# EAGLE schematic HalfECB-Starter (EAGLE 9.3.0)
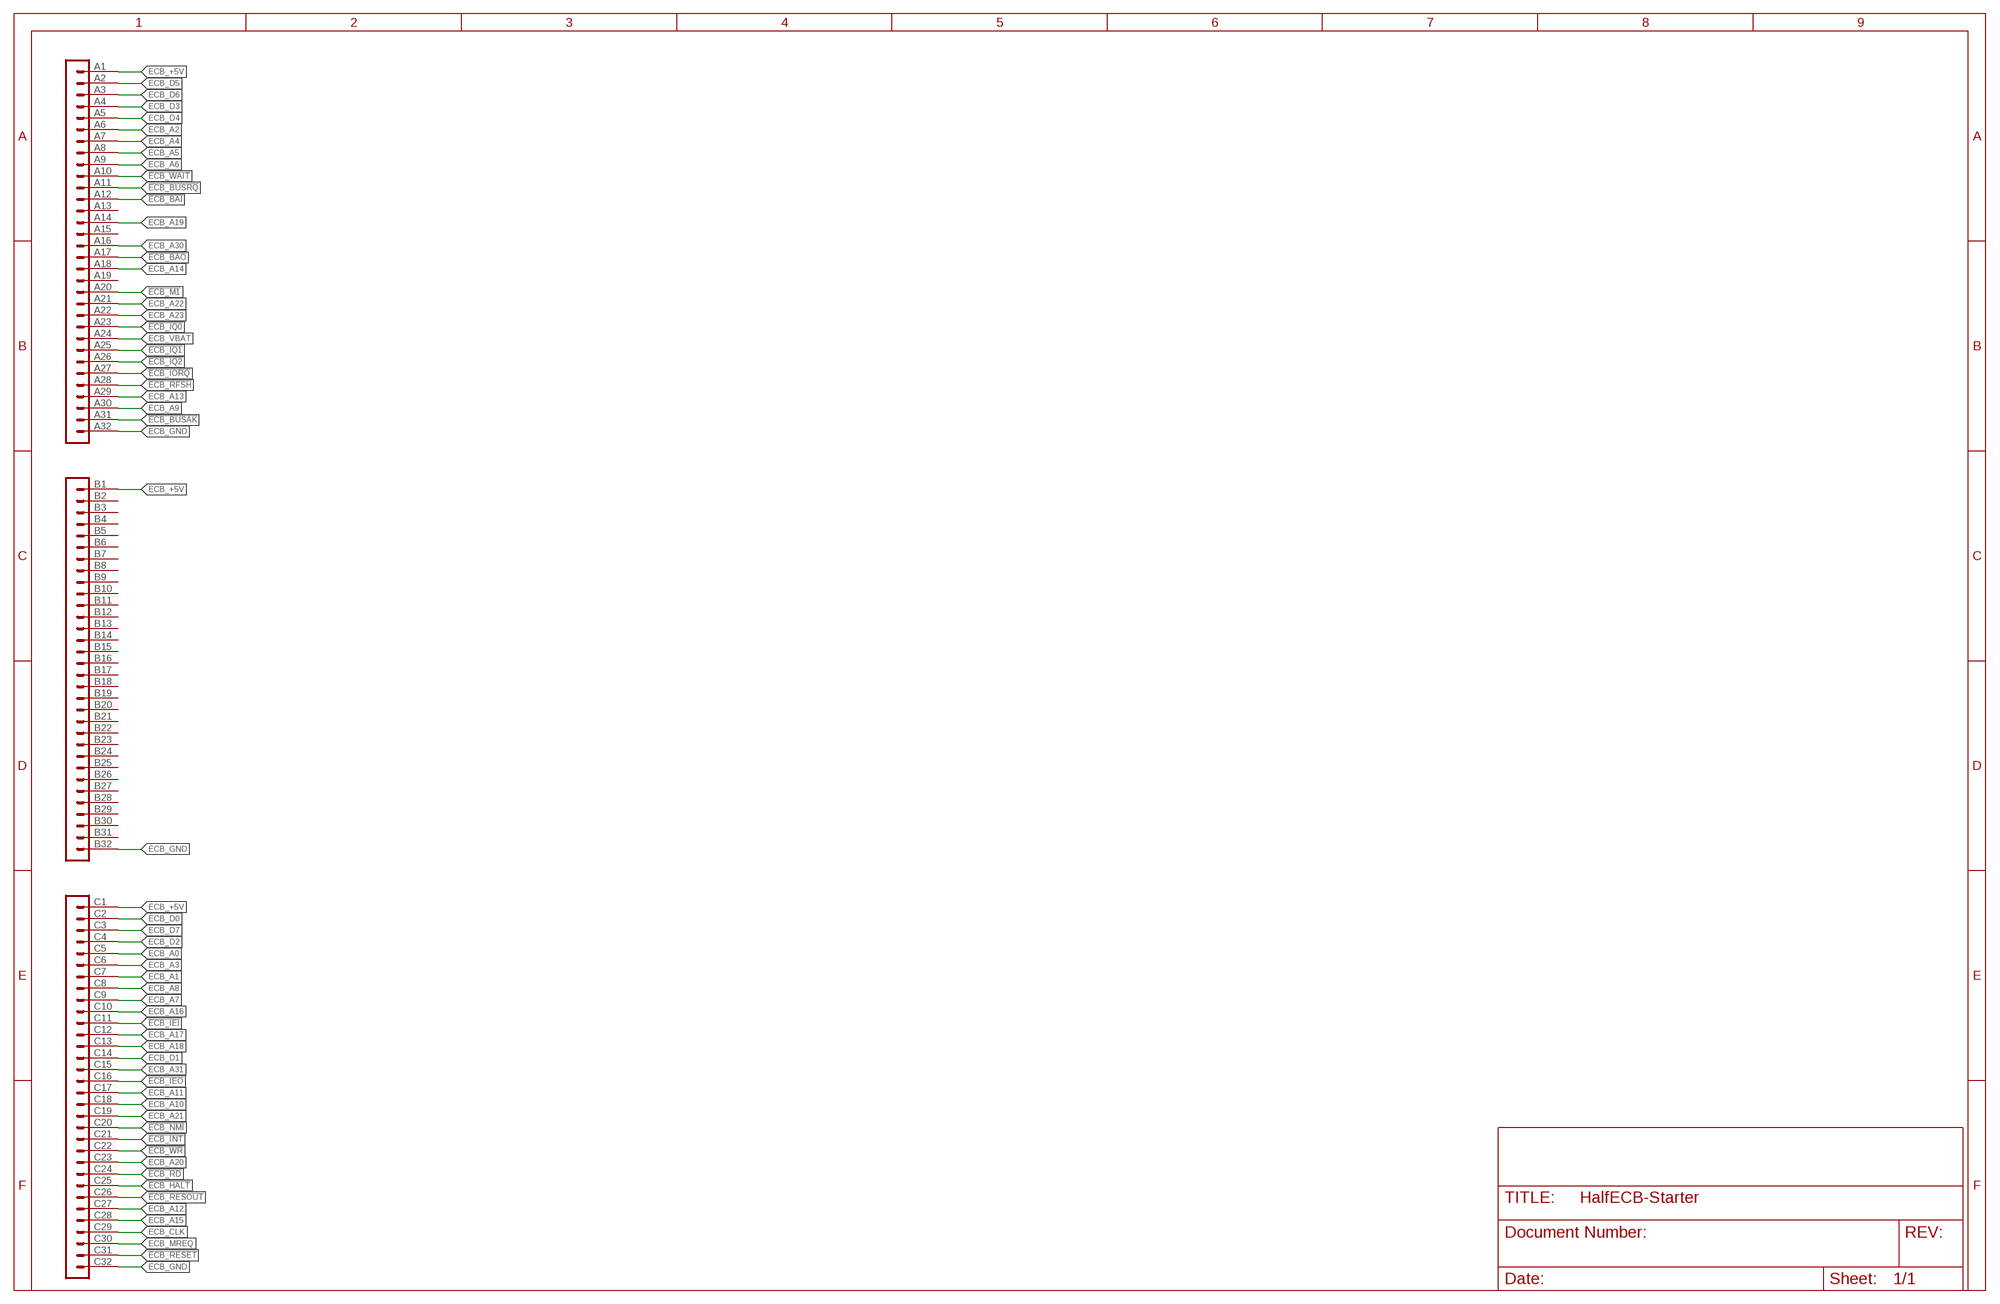
[diagram p0: schematic, sheet 1]

## Parts
J1  VG96-3B  [VG96B]

## Nets
!ECB_BAI: J1.A12
!ECB_BAO: J1.A17
!ECB_BUSAK: J1.A31
!ECB_BUSRQ: J1.A11
!ECB_HALT: J1.C25
!ECB_IEI: J1.C11
!ECB_IEO: J1.C16
!ECB_INT: J1.C21
!ECB_IORQ: J1.A27
!ECB_IQ0: J1.A23
!ECB_IQ1: J1.A25
!ECB_IQ2: J1.A26
!ECB_M1: J1.A20
!ECB_NMI: J1.C20
!ECB_RD: J1.C24
!ECB_RESET: J1.C31
!ECB_RESOUT: J1.C26
!ECB_RFSH: J1.A28
!ECB_WAIT: J1.A10
!ECB_WR: J1.C22
ECB_+5V: J1.A1 J1.B1 J1.C1
ECB_A0: J1.C5
ECB_A1: J1.C7
ECB_A2: J1.A6
ECB_A3: J1.C6
ECB_A4: J1.A7
ECB_A5: J1.A8
ECB_A6: J1.A9
ECB_A7: J1.C9
ECB_A8: J1.C8
ECB_A9: J1.A30
ECB_A10: J1.C18
ECB_A11: J1.C17
ECB_A12: J1.C27
ECB_A13: J1.A29
ECB_A14: J1.A18
ECB_A15: J1.C28
ECB_A16: J1.C10
ECB_A17: J1.C12
ECB_A18: J1.C13
ECB_A19: J1.A14
ECB_A20: J1.C23
ECB_A21: J1.C19
ECB_A22: J1.A21
ECB_A23: J1.A22
ECB_A30: J1.A16
ECB_A31: J1.C15
ECB_CLK: J1.C29
ECB_D0: J1.C2
ECB_D1: J1.C14
ECB_D2: J1.C4
ECB_D3: J1.A4
ECB_D4: J1.A5
ECB_D5: J1.A2
ECB_D6: J1.A3
ECB_D7: J1.C3
ECB_GND: J1.A32 J1.B32 J1.C32
ECB_MREQ: J1.C30
ECB_VBAT: J1.A24
Unconnected: J1.A13 J1.A15 J1.A19 J1.B2 J1.B3 J1.B4 J1.B5 J1.B6 J1.B7 J1.B8 J1.B9 J1.B10 J1.B11 J1.B12 J1.B13 J1.B14 J1.B15 J1.B16 J1.B17 J1.B18 J1.B19 J1.B20 J1.B21 J1.B22 J1.B23 J1.B24 J1.B25 J1.B26 J1.B27 J1.B28 J1.B29 J1.B30 J1.B31

## Library data of the parts
J1 = ECB-Half:VG96-3: PCB EUROCARD, 96-pin type C/ABC, 2.54 mm